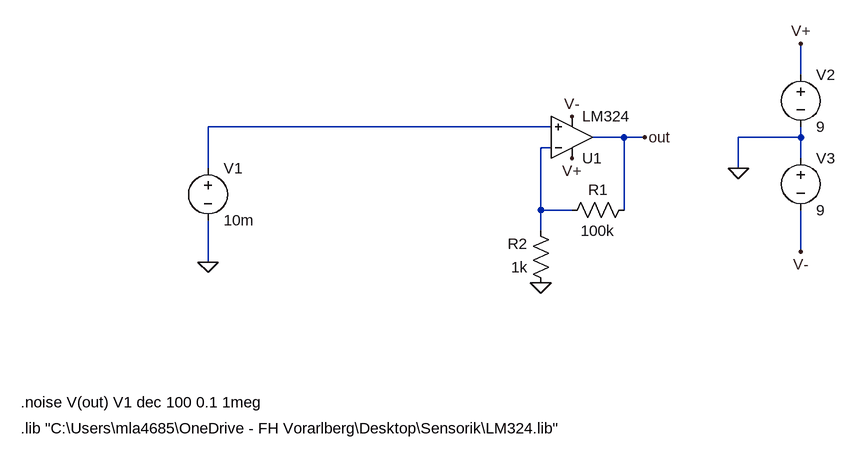
[diagram p0: schematic Umgebung.asc]
Umgebung.asc, the LTspice schematic file:
Version 4.1
SHEET 1 880 680
WIRE 192 -80 192 -128
WIRE -192 0 -720 0
WIRE -80 16 -128 16
WIRE -48 16 -80 16
WIRE 192 16 192 0
WIRE 192 16 96 16
WIRE -192 32 -208 32
WIRE 192 48 192 16
WIRE -720 64 -720 0
WIRE 96 64 96 16
WIRE -208 128 -208 32
WIRE -160 128 -208 128
WIRE -80 128 -80 16
WIRE -208 160 -208 128
WIRE 192 192 192 128
WIRE -720 208 -720 144
FLAG -160 48 V+
FLAG 192 -128 V+
FLAG 192 192 V-
FLAG 96 64 0
FLAG -160 -16 V-
FLAG -720 208 0
FLAG -48 16 out
FLAG -208 240 0
SYMBOL voltage 192 -96 R0
WINDOW 123 0 0 Left 2
WINDOW 39 0 0 Left 2
SYMATTR InstName V2
SYMATTR Value 9
SYMBOL voltage 192 32 R0
WINDOW 123 0 0 Left 2
WINDOW 39 0 0 Left 2
SYMATTR InstName V3
SYMATTR Value 9
SYMBOL Opamps\\opamp2 -160 80 M180
SYMATTR InstName U1
SYMATTR Value LM324
SYMATTR SpiceModel LM324
SYMBOL voltage -720 48 R0
WINDOW 123 24 124 Left 2
WINDOW 39 0 0 Left 2
SYMATTR InstName V1
SYMATTR Value 10m
SYMBOL res -64 112 R90
WINDOW 0 0 56 VBottom 2
WINDOW 3 32 56 VTop 2
SYMATTR InstName R1
SYMATTR Value 100k
SYMBOL res -192 256 R180
WINDOW 0 36 76 Left 2
WINDOW 3 36 40 Left 2
SYMATTR InstName R2
SYMATTR Value 1k
TEXT -1008 464 Left 2 !.lib "C:\\Users\\mla4685\\OneDrive - FH Vorarlberg\\Desktop\\Sensorik\\LM324.lib"
TEXT -1008 424 Left 2 !.noise V(out) V1 dec 100 0.1 1meg

The netlist it stands for:
* Umgebung.asc
V2 V+ 0 9
V3 0 V- 9
X§U1 N001 N002 V+ V- out LM324 LM324  ; pins In+ In- V+ V- OUT
V1 N001 0 10m
R1 out N002 100k
R2 0 N002 1k
.lib "C:\Users\mla4685\OneDrive - FH Vorarlberg\Desktop\Sensorik\LM324.lib"
.noise V(out) V1 dec 100 0.1 1meg
.backanno
.end